# EAGLE design atmega_taos (EAGLE 6.4)
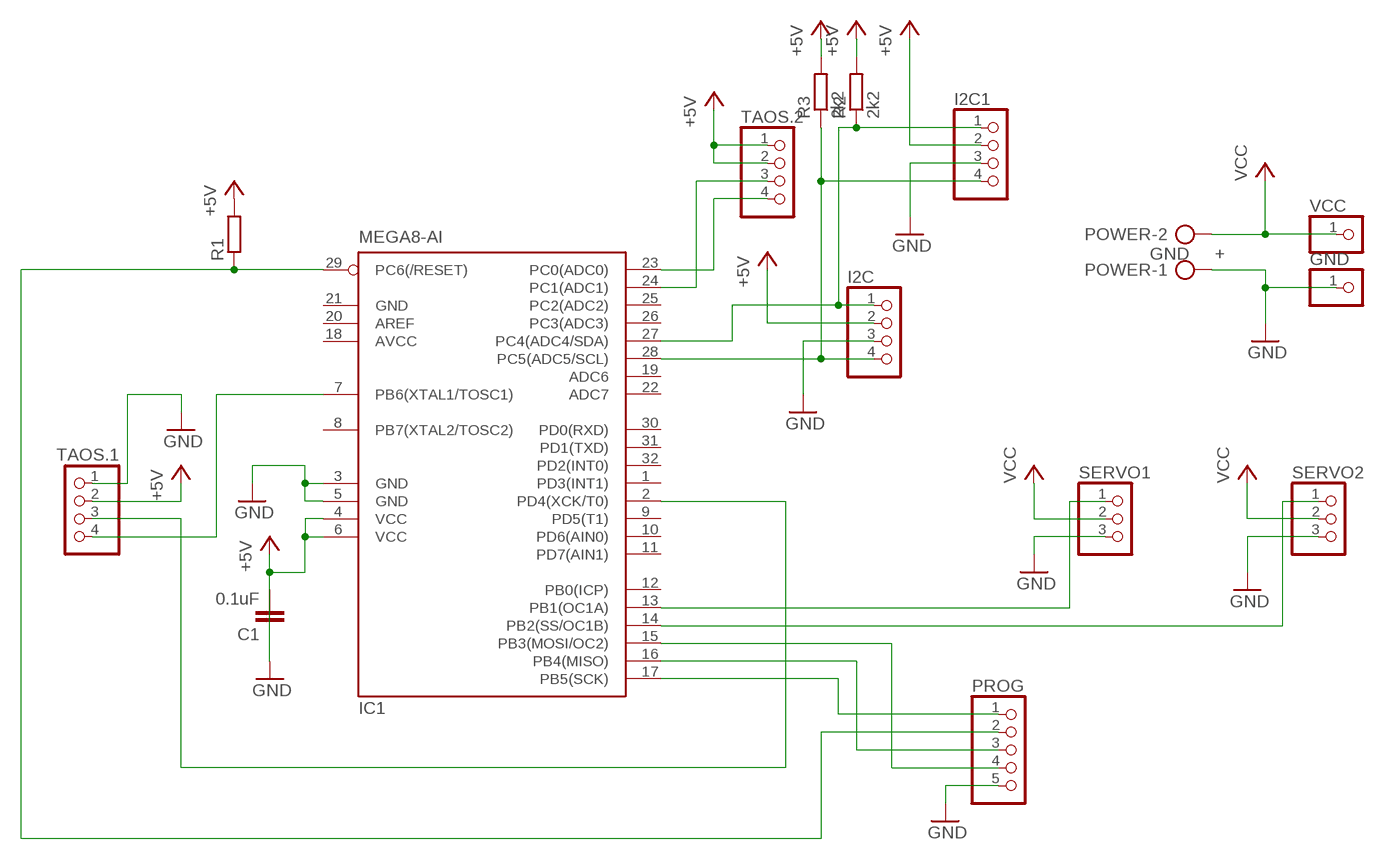
[diagram p0: schematic, sheet 1]

## Parts
C1  0.1uF  CAPACITORC-0805BIG  [0805BIG]
GND  PINHD-1X1  [1X01]
I2C  PINHD-1X4  [1X04]
I2C1  PINHD-1X4  [1X04]
IC1  MEGA8-AI  [TQFP32-08]
POWER  GND +  AK500/2  [AK500/2]
PROG  PINHD-1X5  [1X05]
R1  RESISTORR-0805BIG  [0805BIG]
R2  2k2  RESISTORR-0805BIG  [0805BIG]
R3  2k2  RESISTORR-0805BIG  [0805BIG]
SERVO1  PINHD-1X3  [1X03]
SERVO2  PINHD-1X3  [1X03]
TAOS.1  PINHD-1X4  [1X04]
TAOS.2  PINHD-1X4  [1X04]
VCC  PINHD-1X1  [1X01]

## Nets
+5V: C1.1 I2C1.2 I2C.2 IC1.4(VCC) IC1.6(VCC) R1.2 R2.2 R3.2 TAOS.1.2 TAOS.2.1 TAOS.2.2
GND: C1.2 GND.1 I2C1.3 I2C.3 IC1.3(GND) IC1.5(GND) POWER.1 PROG.5 SERVO1.3 SERVO2.3 TAOS.1.1
N$1: IC1.13(PB1(OC1A)) SERVO1.1
N$2: I2C1.1 I2C.1 IC1.27(PC4(ADC4/SDA)) R2.1
N$3: IC1.2(PD4(XCK/T0)) TAOS.1.3
N$5: IC1.24(PC1(ADC1)) TAOS.2.3
N$6: IC1.23(PC0(ADC0)) TAOS.2.4
N$7: I2C1.4 I2C.4 IC1.28(PC5(ADC5/SCL)) R3.1
N$8: IC1.14(PB2(SS/OC1B)) SERVO2.1
N$9: IC1.7(PB6(XTAL1/TOSC1)) TAOS.1.4
N$10: IC1.15(PB3(MOSI/OC2)) PROG.4
N$11: IC1.29(PC6(/RESET)) PROG.2 R1.1
N$12: IC1.17(PB5(SCK)) PROG.1
N$13: IC1.16(PB4(MISO)) PROG.3
VCC: POWER.2 SERVO1.2 SERVO2.2 VCC.1
Unconnected: IC1.1(PD3(INT1)) IC1.8(PB7(XTAL2/TOSC2)) IC1.9(PD5(T1)) IC1.10(PD6(AIN0)) IC1.11(PD7(AIN1)) IC1.12(PB0(ICP)) IC1.19(ADC6) IC1.20(AREF) IC1.22(ADC7) IC1.25(PC2(ADC2)) IC1.26(PC3(ADC3)) IC1.30(PD0(RXD)) IC1.31(PD1(TXD)) IC1.32(PD2(INT0))

## Power pins joined to a net without a drawn wire
AVCC: IC1.18(AVCC)
GND: IC1.21(GND)

## Library data of the parts
C1 = MART2013:CAPACITOR
GND VCC = pinhead:PINHD-1X1: PIN HEADER
I2C I2C1 TAOS.1 TAOS.2 = pinhead:PINHD-1X4: PIN HEADER
IC1 = atmel:MEGA8: MICROCONTROLLER 8 Kbytes FLASH, 1 kbytes SRAM, 512 bytes EEPROM, USART, 6-channel 10 bit ADC, 2-channel 8 bit ADC Pin compatible with Atmega48, ATMega88, ATMega168 Source: avr.lbr; MPN: ATMEGA8-16AU; OC_FARNELL: 9171371; OC_NEWARK: 73M8863
POWER = con-ptr500:AK500/2: CONNECTOR; OC_FARNELL: unknown; OC_NEWARK: unknown
PROG = pinhead:PINHD-1X5: PIN HEADER
R1-R3 = MART2013:RESISTOR: RESISTOR, European symbol
SERVO1 SERVO2 = pinhead:PINHD-1X3: PIN HEADER

## Board
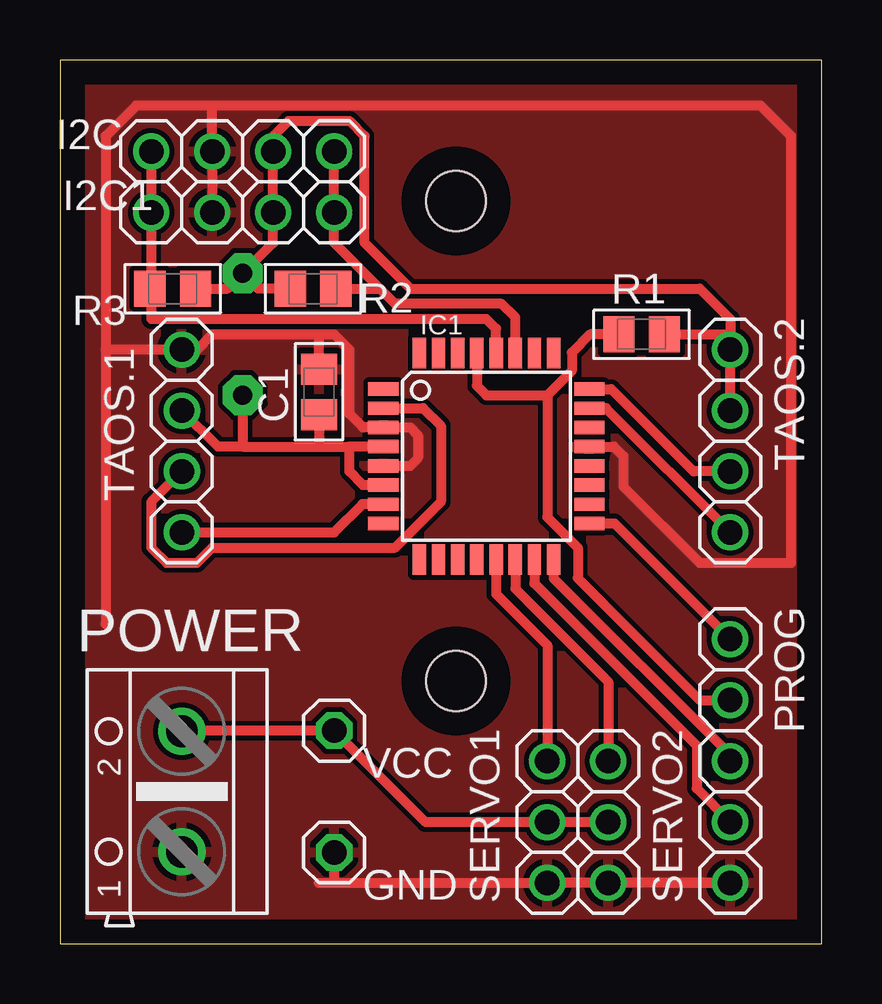
[diagram p1: board, top side]
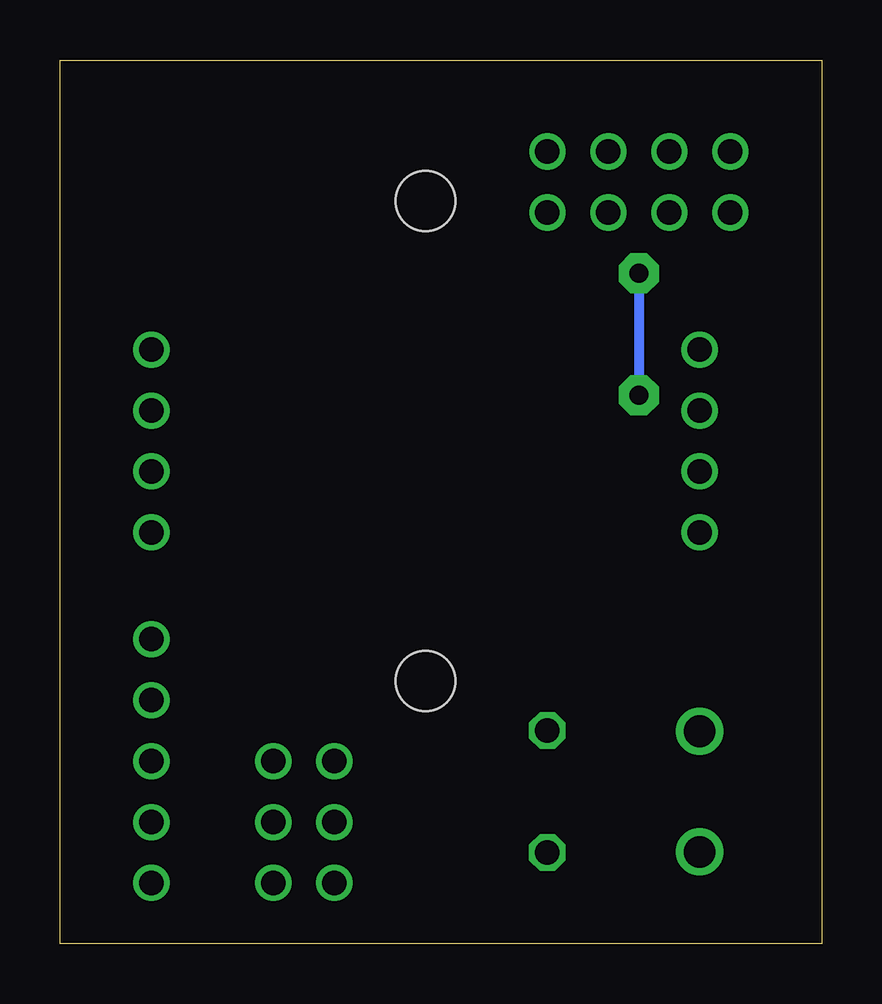
[diagram p2: board, bottom side, seen from below]

Size 31.75 x 36.83 mm. Coordinates in mm from the lower left corner, seen from the top.
Outline: 0,0 31.75,0 31.75,36.83 0,36.83 0,0
Copper layers (1*16): Top 0.035mm / dielectric 1.5mm / Bottom 0.035mm
Design rules "default": minimum track width 10mil, minimum drill 24mil, track to track 8mil, track to pad 8mil, pad to pad 8mil, via to via 8mil, smd to smd 8mil, copper to edge 40mil, drill to drill 8mil, minimum pad ring 10mil, minimum via ring 8mil, stop-mask expansion 4mil, vias tented up to drill 0mil, thermal gap 10mil
Holes 2.5 mm at 16.51,30.95 16.51,10.96

### Footprints (pad centres in the part's own frame; a part is rotated, then mirrored left to right if it is on the bottom)
0805BIG = smd 1.3 x 1.5: 1 -0.95,0; 2 0.95,0
1X01 = drill 1.016 octagon: 1 0,0
1X04 = drill 1.016 long: 1 -3.81,0; 2 -1.27,0; 3 1.27,0; 4 3.81,0
TQFP32-08 = smd 1.27 x 0.559: 1 -4.293,2.8; 2 -4.293,2; 3 -4.293,1.2; 4 -4.293,0.4; 5 -4.293,-0.4; 6 -4.293,-1.2; 7 -4.293,-2; 8 -4.293,-2.8; 17 4.293,-2.8; 18 4.293,-2; 19 4.293,-1.2; 20 4.293,-0.4; 21 4.293,0.4; 22 4.293,1.2; 23 4.293,2; 24 4.293,2.8 | smd 0.559 x 1.27: 9 -2.8,-4.293; 10 -2,-4.293; 11 -1.2,-4.293; 12 -0.4,-4.293; 13 0.4,-4.293; 14 1.2,-4.293; 15 2,-4.293; 16 2.8,-4.293; 25 2.8,4.293; 26 2,4.293; 27 1.2,4.293; 28 0.4,4.293; 29 -0.4,4.293; 30 -1.2,4.293; 31 -2,4.293; 32 -2.8,4.293
AK500/2 = drill 1.321 long: 1 -2.515,0; 2 2.515,0
1X05 = drill 1.016 long: 1 -5.08,0; 2 -2.54,0; 3 0,0; 4 2.54,0; 5 5.08,0
1X03 = drill 1.016 long: 1 -2.54,0; 2 0,0; 3 2.54,0

### Placement (x,y rotation side)
C1  10.79,23 90 top
GND  11.43,3.81 0 top
I2C  7.62,33.02 180 top
I2C1  7.62,30.48 180 top
IC1  17.78,20.32 0 top
POWER  5.08,6.35 90 top
PROG  27.94,7.62 270 top
R1  24.25,25.4 0 top
R2  10.55,27.3 180 top
R3  4.7,27.3 0 top
SERVO1  20.32,5.08 270 top
SERVO2  22.86,5.08 270 top
TAOS.1  5.08,20.95 270 top
TAOS.2  27.94,20.95 270 top
VCC  11.43,8.89 0 top

### Tracks (layer width: path | path; a pad name or v marks a point on that pad's centre or on a via)
+5V  (via drill 0.8 pad 1.68)
  Top 0.406: TAOS.2.2 TAOS.2.1 27.94,25.4 | 7.62,20.72 6.58,20.72 TAOS.1.2 | 27.94,25.4 27.94,26.04 26.67,27.3 14.61,27.3 12.7,29.21 12.7,33.66 12.06,34.29 9.53,34.29 8.89,33.66 I2C.2 I2C1.2 8.89,29.21 v7.62,27.94 | IC1.4 12.06,20.72 | IC1.6 12.63,19.12 12.06,19.68 12.06,20.72 | v7.62,22.86 7.62,20.72 | 7.62,20.72 10.79,20.72 | 10.79,20.72 12.06,20.72 | C1.1 10.79,20.72 | R3.2 6.99,27.3 v7.62,27.94 | R2.2 8.26,27.3 v7.62,27.94 | R1.2 27.94,25.4
  Bottom 0.406: v7.62,27.94 v7.62,22.86
GND
  Top 0.406: 1.91,24.77 1.91,33.66 3.17,34.92 6.35,34.92 | 1.91,24.77 TAOS.1.1 5.71,24.77 6.35,25.4 10.79,25.4 | 25.4,2.54 PROG.5 SERVO1.3 11.43,2.54 | 10.79,25.4 11.43,25.4 12.06,24.77 12.06,22.09 12.63,21.52 IC1.3 14.61,21.52 14.92,21.2 14.92,20.24 14.61,19.92 IC1.5 | IC1.21 23.09,20.72 23.5,20.32 23.5,19.05 26.67,15.88 30.48,15.88 30.48,33.66 29.21,34.92 6.35,34.92 | 6.35,34.92 I2C.3 I2C1.3 | 1.91,24.77 1.91,13.34 | 10.79,2.54 11.43,2.54 | GND.1 11.43,2.54 | C1.2 10.79,25.4
  pour Top: 0,36.83 0,0 31.75,0 31.75,36.83
N$1
  Top 0.406: IC1.13 18.18,14.59 20.32,12.45 SERVO1.1
N$2
  Top 0.406: IC1.27 18.98,26.11 18.41,26.67 13.97,26.67 13.34,27.3 | 13.34,27.3 11.43,29.21 I2C1.1 I2C.1 | R2.1 13.34,27.3
N$3
  Top 0.406: TAOS.1.3 3.81,18.41 3.81,16.51 4.45,15.88 5.71,15.88 6.35,16.51 13.97,16.51 15.88,18.41 15.88,21.59 15.14,22.32 IC1.2
N$5
  Top 0.406: IC1.24 22.98,23.12 26.42,19.68 TAOS.2.3
N$6
  Top 0.406: IC1.23 22.77,22.32 TAOS.2.4
N$7
  Top 0.406: IC1.28 18.18,25.64 17.78,26.04 3.81,26.04 3.81,27.3 | I2C.4 I2C1.4 3.81,27.3 | R3.1 3.81,27.3
N$8
  Top 0.406: IC1.14 18.98,14.8 22.86,10.92 SERVO2.1
N$9
  Top 0.406: TAOS.1.4 11.43,17.14 12.61,18.32 IC1.7
N$10
  Top 0.406: PROG.4 26.54,6.48 26.54,8.26 19.78,15.02 IC1.15
N$11
  Top 0.406: PROG.2 26.67,10.16 21.59,15.24 21.59,16.51 20.32,17.78 20.32,22.86 | IC1.29 17.38,23.26 17.78,22.86 20.32,22.86 | 20.32,22.86 21.34,23.88 21.34,24.64 22.1,25.4 R1.1
N$12
  Top 0.406: IC1.17 23.12,17.52 PROG.1
N$13
  Top 0.406: IC1.16 20.58,15.23 27.81,8 PROG.3
VCC
  Top 0.406: SERVO2.2 SERVO1.2 15.24,5.08 VCC.1 5.08,8.89 POWER.2